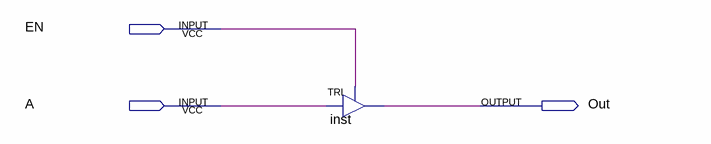
[diagram p0: schematic sheet]
// Quartus schematic ep2_1.bdf as structural Verilog: 1 symbols, 3 pins
module ep2_1 (
  input  EN,
  input  A,
  output Out
);

  TRI inst (.IN(A), .OE(EN), .OUT(Out));
endmodule
